# EAGLE design ISSI Driver OSRAM DEL (EAGLE 6.5.0)
Dev board for the ISSI driver with OSRAM LEDs

## Sheet 1 of 2: Drivers
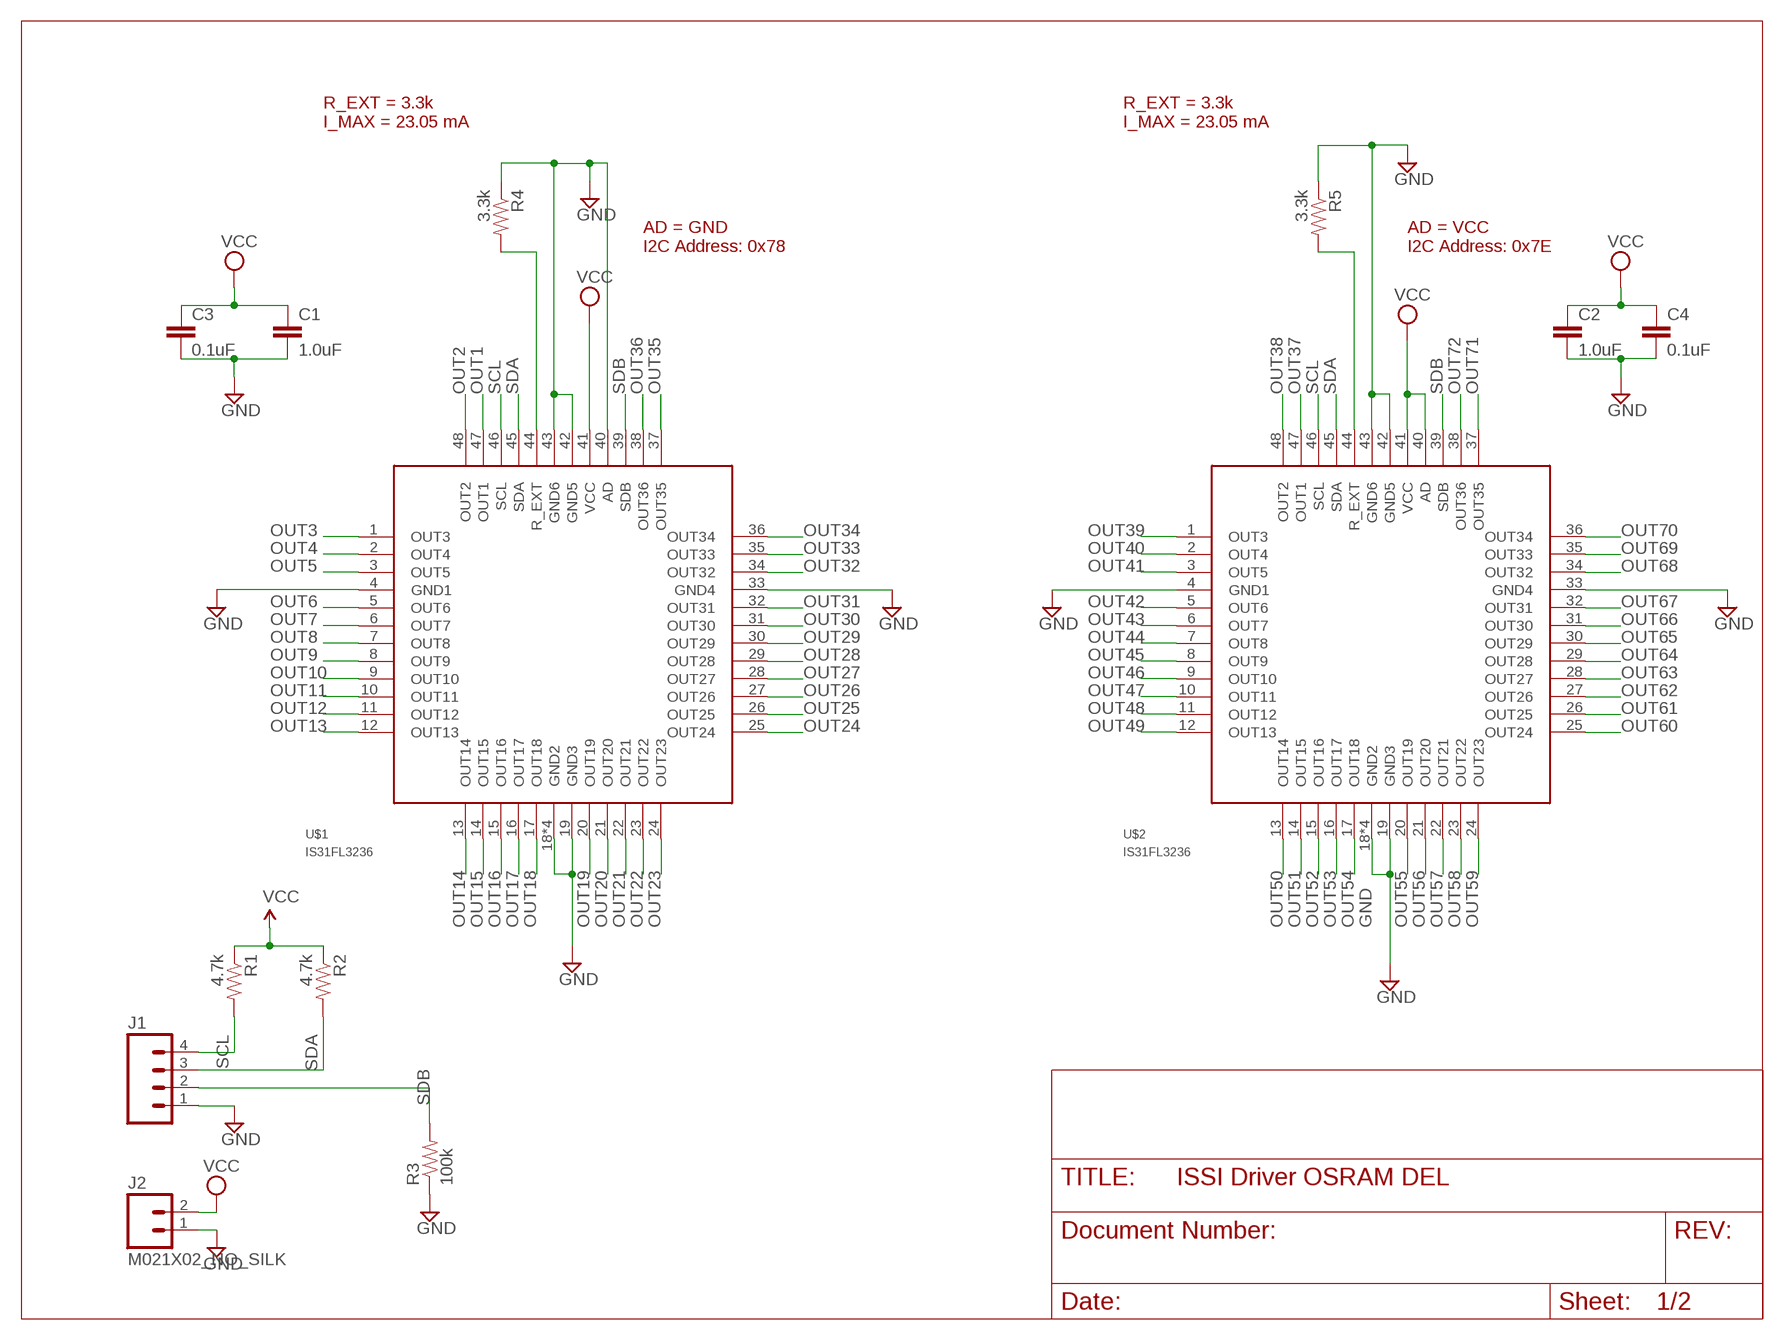
[diagram p0: schematic, sheet 1]

### Parts
C1  1.0uF  1.0UF-16V-10%(0603)  [0603-CAP]
C2  1.0uF  1.0UF-16V-10%(0603)  [0603-CAP]
C3  0.1uF  0.1UF-25V-5%(0603)  [0603-CAP]
C4  0.1uF  0.1UF-25V-5%(0603)  [0603-CAP]
J1  M041X04_NO_SILK  [1X04_NO_SILK]
J2  M021X02_NO_SILK  [1X02_NO_SILK]
R1  4.7k  4.7KOHM1/10W1%(0603)  [0603]
R2  4.7k  4.7KOHM1/10W1%(0603)  [0603]
R3  100k  100KOHM1/10W1%(0603)  [0603-RES]
R4  3.3k  8.2KOHM-1/10W-5%(0603)  [0603-RES]
R5  3.3k  8.2KOHM-1/10W-5%(0603)  [0603-RES]
U$1  IS31FL3236  [TQFP48]
U$2  IS31FL3236  [TQFP48]

### Nets
GND [GND]: C1.2 C2.2 C3.2 C4.2 J1.1 J2.1 R3.1 R4.1 R5.1 U$1.4(GND1) U$1.18(GND2) U$1.19(GND3) U$1.33(GND4) U$1.40(AD) U$1.42(GND5) U$1.43(GND6) U$1.THERMALPAD(GND2) U$1.THERMALVIA1(GND2) U$1.THERMALVIA2(GND2) U$2.4(GND1) U$2.18(GND2) U$2.19(GND3) U$2.33(GND4) U$2.42(GND5) U$2.43(GND6) U$2.THERMALPAD(GND2) U$2.THERMALVIA1(GND2) U$2.THERMALVIA2(GND2)
N$5: R4.2 U$1.44(R_EXT)
N$44: R5.2 U$2.44(R_EXT)
OUT1: U$1.47(OUT1) ; also sheet 2
OUT2: U$1.48(OUT2) ; also sheet 2
OUT3: U$1.1(OUT3) ; also sheet 2
OUT4: U$1.2(OUT4) ; also sheet 2
OUT5: U$1.3(OUT5) ; also sheet 2
OUT6: U$1.5(OUT6) ; also sheet 2
OUT7: U$1.6(OUT7) ; also sheet 2
OUT8: U$1.7(OUT8) ; also sheet 2
OUT9: U$1.8(OUT9) ; also sheet 2
OUT10: U$1.9(OUT10) ; also sheet 2
OUT11: U$1.10(OUT11) ; also sheet 2
OUT12: U$1.11(OUT12) ; also sheet 2
OUT13: U$1.12(OUT13) ; also sheet 2
OUT14: U$1.13(OUT14) ; also sheet 2
OUT15: U$1.14(OUT15) ; also sheet 2
OUT16: U$1.15(OUT16) ; also sheet 2
OUT17: U$1.16(OUT17) ; also sheet 2
OUT18: U$1.17(OUT18) ; also sheet 2
OUT19: U$1.20(OUT19) ; also sheet 2
OUT20: U$1.21(OUT20) ; also sheet 2
OUT21: U$1.22(OUT21) ; also sheet 2
OUT22: U$1.23(OUT22) ; also sheet 2
OUT23: U$1.24(OUT23) ; also sheet 2
OUT24: U$1.25(OUT24) ; also sheet 2
OUT25: U$1.26(OUT25) ; also sheet 2
OUT26: U$1.27(OUT26) ; also sheet 2
OUT27: U$1.28(OUT27) ; also sheet 2
OUT28: U$1.29(OUT28) ; also sheet 2
OUT29: U$1.30(OUT29) ; also sheet 2
OUT30: U$1.31(OUT30) ; also sheet 2
OUT31: U$1.32(OUT31) ; also sheet 2
OUT32: U$1.34(OUT32) ; also sheet 2
OUT33: U$1.35(OUT33) ; also sheet 2
OUT34: U$1.36(OUT34) ; also sheet 2
OUT35: U$1.37(OUT35) ; also sheet 2
OUT36: U$1.38(OUT36) ; also sheet 2
OUT37: U$2.47(OUT1) ; also sheet 2
OUT38: U$2.48(OUT2) ; also sheet 2
OUT39: U$2.1(OUT3) ; also sheet 2
OUT40: U$2.2(OUT4) ; also sheet 2
OUT41: U$2.3(OUT5) ; also sheet 2
OUT42: U$2.5(OUT6) ; also sheet 2
OUT43: U$2.6(OUT7) ; also sheet 2
OUT44: U$2.7(OUT8) ; also sheet 2
OUT45: U$2.8(OUT9) ; also sheet 2
OUT46: U$2.9(OUT10) ; also sheet 2
OUT47: U$2.10(OUT11) ; also sheet 2
OUT48: U$2.11(OUT12) ; also sheet 2
OUT49: U$2.12(OUT13) ; also sheet 2
OUT50: U$2.13(OUT14) ; also sheet 2
OUT51: U$2.14(OUT15) ; also sheet 2
OUT52: U$2.15(OUT16) ; also sheet 2
OUT53: U$2.16(OUT17) ; also sheet 2
OUT54: U$2.17(OUT18) ; also sheet 2
OUT55: U$2.20(OUT19) ; also sheet 2
OUT56: U$2.21(OUT20) ; also sheet 2
OUT57: U$2.22(OUT21) ; also sheet 2
OUT58: U$2.23(OUT22) ; also sheet 2
OUT59: U$2.24(OUT23) ; also sheet 2
OUT60: U$2.25(OUT24) ; also sheet 2
OUT61: U$2.26(OUT25) ; also sheet 2
OUT62: U$2.27(OUT26) ; also sheet 2
OUT63: U$2.28(OUT27) ; also sheet 2
OUT64: U$2.29(OUT28) ; also sheet 2
OUT65: U$2.30(OUT29) ; also sheet 2
OUT66: U$2.31(OUT30) ; also sheet 2
OUT67: U$2.32(OUT31) ; also sheet 2
OUT68: U$2.34(OUT32) ; also sheet 2
OUT69: U$2.35(OUT33) ; also sheet 2
OUT70: U$2.36(OUT34) ; also sheet 2
OUT71: U$2.37(OUT35) ; also sheet 2
OUT72: U$2.38(OUT36) ; also sheet 2
SCL: J1.4 R1.2 U$1.46(SCL) U$2.46(SCL)
SDA: J1.3 R2.2 U$1.45(SDA) U$2.45(SDA)
SDB: J1.2 R3.2 U$1.39(SDB) U$2.39(SDB)
VCC [VCC]: C1.1 C2.1 C3.1 C4.1 J2.2 R1.1 R2.1 U$1.41(VCC) U$2.40(AD) U$2.41(VCC) ; also sheet 2

### Notes on the sheet
- R_EXT = 3.3k
  I_MAX = 23.05 mA
- R_EXT = 3.3k
  I_MAX = 23.05 mA
- AD = GND
  I2C Address: 0x78
- AD = VCC
  I2C Address: 0x7E

## Sheet 2 of 2: LEDS
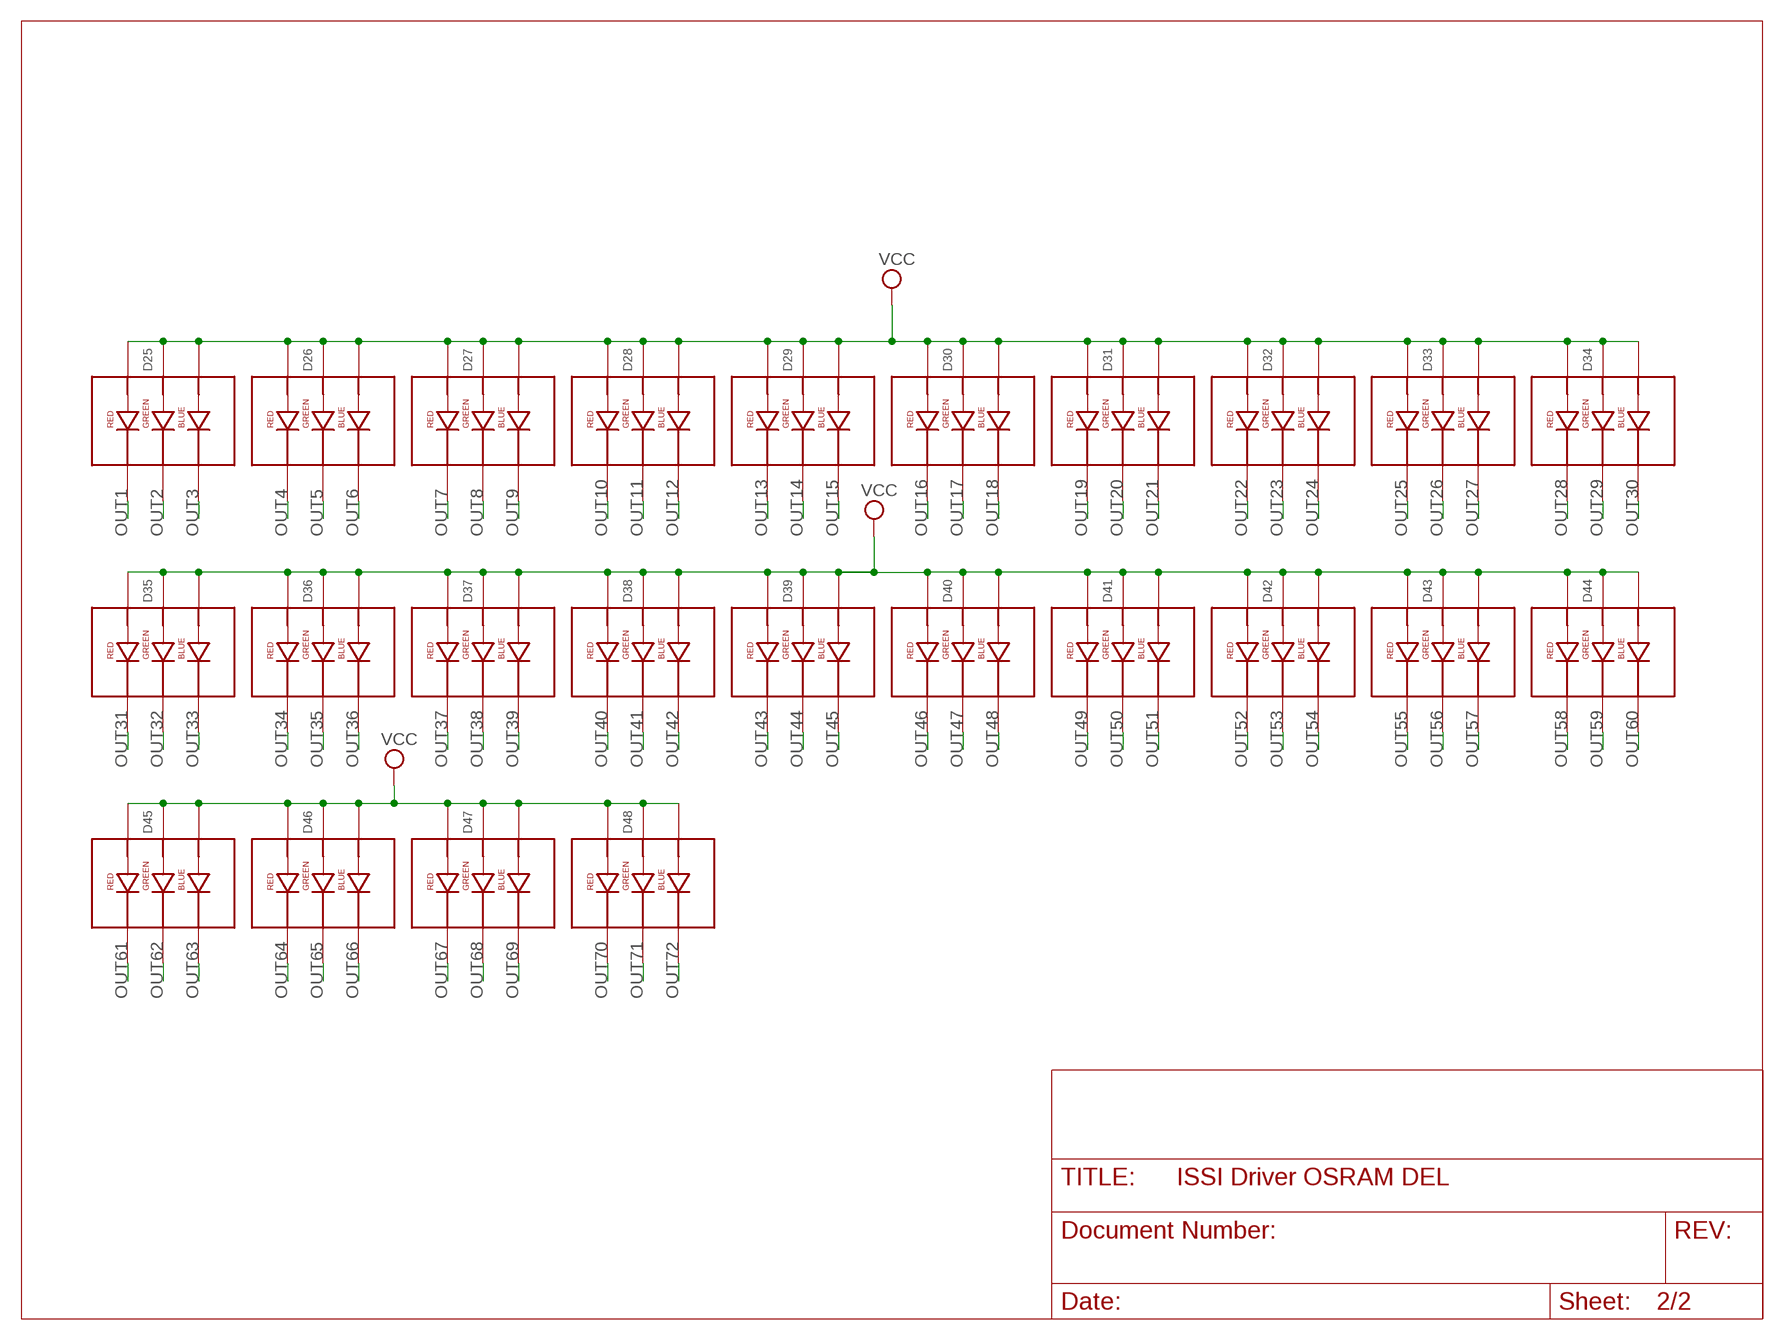
[diagram p1: schematic, sheet 2]

### Parts
D25  LRTB_GVTG-U5V5-1LPCC6SMALL  [LPCC6SMALL]
D26  LRTB_GVTG-U5V5-1LPCC6SMALL  [LPCC6SMALL]
D27  LRTB_GVTG-U5V5-1LPCC6SMALL  [LPCC6SMALL]
D28  LRTB_GVTG-U5V5-1LPCC6SMALL  [LPCC6SMALL]
D29  LRTB_GVTG-U5V5-1LPCC6SMALL  [LPCC6SMALL]
D30  LRTB_GVTG-U5V5-1LPCC6SMALL  [LPCC6SMALL]
D31  LRTB_GVTG-U5V5-1LPCC6SMALL  [LPCC6SMALL]
D32  LRTB_GVTG-U5V5-1LPCC6SMALL  [LPCC6SMALL]
D33  LRTB_GVTG-U5V5-1LPCC6SMALL  [LPCC6SMALL]
D34  LRTB_GVTG-U5V5-1LPCC6SMALL  [LPCC6SMALL]
D35  LRTB_GVTG-U5V5-1LPCC6SMALL  [LPCC6SMALL]
D36  LRTB_GVTG-U5V5-1LPCC6SMALL  [LPCC6SMALL]
D37  LRTB_GVTG-U5V5-1LPCC6SMALL  [LPCC6SMALL]
D38  LRTB_GVTG-U5V5-1LPCC6SMALL  [LPCC6SMALL]
D39  LRTB_GVTG-U5V5-1LPCC6SMALL  [LPCC6SMALL]
D40  LRTB_GVTG-U5V5-1LPCC6SMALL  [LPCC6SMALL]
D41  LRTB_GVTG-U5V5-1LPCC6SMALL  [LPCC6SMALL]
D42  LRTB_GVTG-U5V5-1LPCC6SMALL  [LPCC6SMALL]
D43  LRTB_GVTG-U5V5-1LPCC6SMALL  [LPCC6SMALL]
D44  LRTB_GVTG-U5V5-1LPCC6SMALL  [LPCC6SMALL]
D45  LRTB_GVTG-U5V5-1LPCC6SMALL  [LPCC6SMALL]
D46  LRTB_GVTG-U5V5-1LPCC6SMALL  [LPCC6SMALL]
D47  LRTB_GVTG-U5V5-1LPCC6SMALL  [LPCC6SMALL]
D48  LRTB_GVTG-U5V5-1LPCC6SMALL  [LPCC6SMALL]

### Nets
OUT1: D25.C3(RED_CATHODE) ; also sheet 1
OUT2: D25.C2(GREEN_CATHODE) ; also sheet 1
OUT3: D25.C1(BLUE_CATHODE) ; also sheet 1
OUT4: D26.C3(RED_CATHODE) ; also sheet 1
OUT5: D26.C2(GREEN_CATHODE) ; also sheet 1
OUT6: D26.C1(BLUE_CATHODE) ; also sheet 1
OUT7: D27.C3(RED_CATHODE) ; also sheet 1
OUT8: D27.C2(GREEN_CATHODE) ; also sheet 1
OUT9: D27.C1(BLUE_CATHODE) ; also sheet 1
OUT10: D28.C3(RED_CATHODE) ; also sheet 1
OUT11: D28.C2(GREEN_CATHODE) ; also sheet 1
OUT12: D28.C1(BLUE_CATHODE) ; also sheet 1
OUT13: D29.C3(RED_CATHODE) ; also sheet 1
OUT14: D29.C2(GREEN_CATHODE) ; also sheet 1
OUT15: D29.C1(BLUE_CATHODE) ; also sheet 1
OUT16: D30.C3(RED_CATHODE) ; also sheet 1
OUT17: D30.C2(GREEN_CATHODE) ; also sheet 1
OUT18: D30.C1(BLUE_CATHODE) ; also sheet 1
OUT19: D31.C3(RED_CATHODE) ; also sheet 1
OUT20: D31.C2(GREEN_CATHODE) ; also sheet 1
OUT21: D31.C1(BLUE_CATHODE) ; also sheet 1
OUT22: D32.C3(RED_CATHODE) ; also sheet 1
OUT23: D32.C2(GREEN_CATHODE) ; also sheet 1
OUT24: D32.C1(BLUE_CATHODE) ; also sheet 1
OUT25: D33.C3(RED_CATHODE) ; also sheet 1
OUT26: D33.C2(GREEN_CATHODE) ; also sheet 1
OUT27: D33.C1(BLUE_CATHODE) ; also sheet 1
OUT28: D34.C3(RED_CATHODE) ; also sheet 1
OUT29: D34.C2(GREEN_CATHODE) ; also sheet 1
OUT30: D34.C1(BLUE_CATHODE) ; also sheet 1
OUT31: D35.C3(RED_CATHODE) ; also sheet 1
OUT32: D35.C2(GREEN_CATHODE) ; also sheet 1
OUT33: D35.C1(BLUE_CATHODE) ; also sheet 1
OUT34: D36.C3(RED_CATHODE) ; also sheet 1
OUT35: D36.C2(GREEN_CATHODE) ; also sheet 1
OUT36: D36.C1(BLUE_CATHODE) ; also sheet 1
OUT37: D37.C3(RED_CATHODE) ; also sheet 1
OUT38: D37.C2(GREEN_CATHODE) ; also sheet 1
OUT39: D37.C1(BLUE_CATHODE) ; also sheet 1
OUT40: D38.C3(RED_CATHODE) ; also sheet 1
OUT41: D38.C2(GREEN_CATHODE) ; also sheet 1
OUT42: D38.C1(BLUE_CATHODE) ; also sheet 1
OUT43: D39.C3(RED_CATHODE) ; also sheet 1
OUT44: D39.C2(GREEN_CATHODE) ; also sheet 1
OUT45: D39.C1(BLUE_CATHODE) ; also sheet 1
OUT46: D40.C3(RED_CATHODE) ; also sheet 1
OUT47: D40.C2(GREEN_CATHODE) ; also sheet 1
OUT48: D40.C1(BLUE_CATHODE) ; also sheet 1
OUT49: D41.C3(RED_CATHODE) ; also sheet 1
OUT50: D41.C2(GREEN_CATHODE) ; also sheet 1
OUT51: D41.C1(BLUE_CATHODE) ; also sheet 1
OUT52: D42.C3(RED_CATHODE) ; also sheet 1
OUT53: D42.C2(GREEN_CATHODE) ; also sheet 1
OUT54: D42.C1(BLUE_CATHODE) ; also sheet 1
OUT55: D43.C3(RED_CATHODE) ; also sheet 1
OUT56: D43.C2(GREEN_CATHODE) ; also sheet 1
OUT57: D43.C1(BLUE_CATHODE) ; also sheet 1
OUT58: D44.C3(RED_CATHODE) ; also sheet 1
OUT59: D44.C2(GREEN_CATHODE) ; also sheet 1
OUT60: D44.C1(BLUE_CATHODE) ; also sheet 1
OUT61: D45.C3(RED_CATHODE) ; also sheet 1
OUT62: D45.C2(GREEN_CATHODE) ; also sheet 1
OUT63: D45.C1(BLUE_CATHODE) ; also sheet 1
OUT64: D46.C3(RED_CATHODE) ; also sheet 1
OUT65: D46.C2(GREEN_CATHODE) ; also sheet 1
OUT66: D46.C1(BLUE_CATHODE) ; also sheet 1
OUT67: D47.C3(RED_CATHODE) ; also sheet 1
OUT68: D47.C2(GREEN_CATHODE) ; also sheet 1
OUT69: D47.C1(BLUE_CATHODE) ; also sheet 1
OUT70: D48.C3(RED_CATHODE) ; also sheet 1
OUT71: D48.C2(GREEN_CATHODE) ; also sheet 1
OUT72: D48.C1(BLUE_CATHODE) ; also sheet 1
VCC [VCC]: D25.A1(BLUE_ANODE) D25.A2(GREEN_ANODE) D25.A3(RED_ANODE) D26.A1(BLUE_ANODE) D26.A2(GREEN_ANODE) D26.A3(RED_ANODE) D27.A1(BLUE_ANODE) D27.A2(GREEN_ANODE) D27.A3(RED_ANODE) D28.A1(BLUE_ANODE) D28.A2(GREEN_ANODE) D28.A3(RED_ANODE) D29.A1(BLUE_ANODE) D29.A2(GREEN_ANODE) D29.A3(RED_ANODE) D30.A1(BLUE_ANODE) D30.A2(GREEN_ANODE) D30.A3(RED_ANODE) D31.A1(BLUE_ANODE) D31.A2(GREEN_ANODE) D31.A3(RED_ANODE) D32.A1(BLUE_ANODE) D32.A2(GREEN_ANODE) D32.A3(RED_ANODE) D33.A1(BLUE_ANODE) D33.A2(GREEN_ANODE) D33.A3(RED_ANODE) D34.A1(BLUE_ANODE) D34.A2(GREEN_ANODE) D34.A3(RED_ANODE) D35.A1(BLUE_ANODE) D35.A2(GREEN_ANODE) D35.A3(RED_ANODE) D36.A1(BLUE_ANODE) D36.A2(GREEN_ANODE) D36.A3(RED_ANODE) D37.A1(BLUE_ANODE) D37.A2(GREEN_ANODE) D37.A3(RED_ANODE) D38.A1(BLUE_ANODE) D38.A2(GREEN_ANODE) D38.A3(RED_ANODE) D39.A1(BLUE_ANODE) D39.A2(GREEN_ANODE) D39.A3(RED_ANODE) D40.A1(BLUE_ANODE) D40.A2(GREEN_ANODE) D40.A3(RED_ANODE) D41.A1(BLUE_ANODE) D41.A2(GREEN_ANODE) D41.A3(RED_ANODE) D42.A1(BLUE_ANODE) D42.A2(GREEN_ANODE) D42.A3(RED_ANODE) D43.A1(BLUE_ANODE) D43.A2(GREEN_ANODE) D43.A3(RED_ANODE) D44.A1(BLUE_ANODE) D44.A2(GREEN_ANODE) D44.A3(RED_ANODE) D45.A1(BLUE_ANODE) D45.A2(GREEN_ANODE) D45.A3(RED_ANODE) D46.A1(BLUE_ANODE) D46.A2(GREEN_ANODE) D46.A3(RED_ANODE) D47.A1(BLUE_ANODE) D47.A2(GREEN_ANODE) D47.A3(RED_ANODE) D48.A1(BLUE_ANODE) D48.A2(GREEN_ANODE) D48.A3(RED_ANODE) ; also sheet 1

## Library data of the parts
C1 C2 = SparkFun-Capacitors:1.0UF-16V-10%(0603): CAP-00868; PROD_ID: CAP-00868
C3 C4 = SparkFun-Capacitors:0.1UF-25V-5%(0603): CAP-08604; PROD_ID: CAP-08604
D25-D48 = issi:LRTB_GVTG-U5V5-1: Osram LRTB GVTG RGB MULTILED Source: http://www.osram-os.com/Graphics/XPic9/00155765_0.pdf/LRTB%20GVTG%20-%20MULTILED.pdf
J1 = SparkFun-Connectors:M04: Header 4 Standard 4-pin 0.1" header. Use with straight break away headers (SKU : PRT-00116), right angle break away headers (PRT-00553), swiss pins (PRT-00743), machine pins (PRT-00117), and female headers (PRT-00115). Molex polarized connector foot print use with SKU : PRT-08231 with associated crimp pins and housings. 1MM SMD Version SKU: PRT-10208
J2 = SparkFun-Connectors:M02: Standard 2-pin 0.1" header. Use with - straight break away headers ( PRT-00116) - right angle break away headers (PRT-00553) - swiss pins (PRT-00743) - machine pins (PRT-00117) - female headers (PRT-00115) Molex polarized connector foot print use with: PRT-08233 with associated crimp pins and housings. 2.54_SCREWTERM for use with PRT-10571. 3.5mm Screw Terminal footprints for PRT-08084 5mm Screw Terminal footprints for use with PRT-08433
R1 R2 = SparkFun-Resistors:4.7KOHM1/10W1%(0603): RES-07857; PROD_ID: RES-07857
R3 = SparkFun-Resistors:100KOHM1/10W1%(0603): RES-07828; PROD_ID: RES-07828
R4 R5 = SparkFun-Resistors:8.2KOHM-1/10W-5%(0603): RES-10646; PROD_ID: RES-10646
U$1 U$2 = issi:IS31FL3236: 36 CHANNELS LED DRIVER 36 constant current led driver channels with independent PWM control. Source: http://www.issi.com/WW/pdf/31FL3236.pdf

## Net classes
0 default: width 0.203 mm, drill 0.33 mm, clearance 0.152 mm
1 VCC: width 0.305 mm, drill 0.381 mm, clearance 0.203 mm
2 GND: width 0.305 mm, drill 0.381 mm, clearance 0.203 mm

## Board
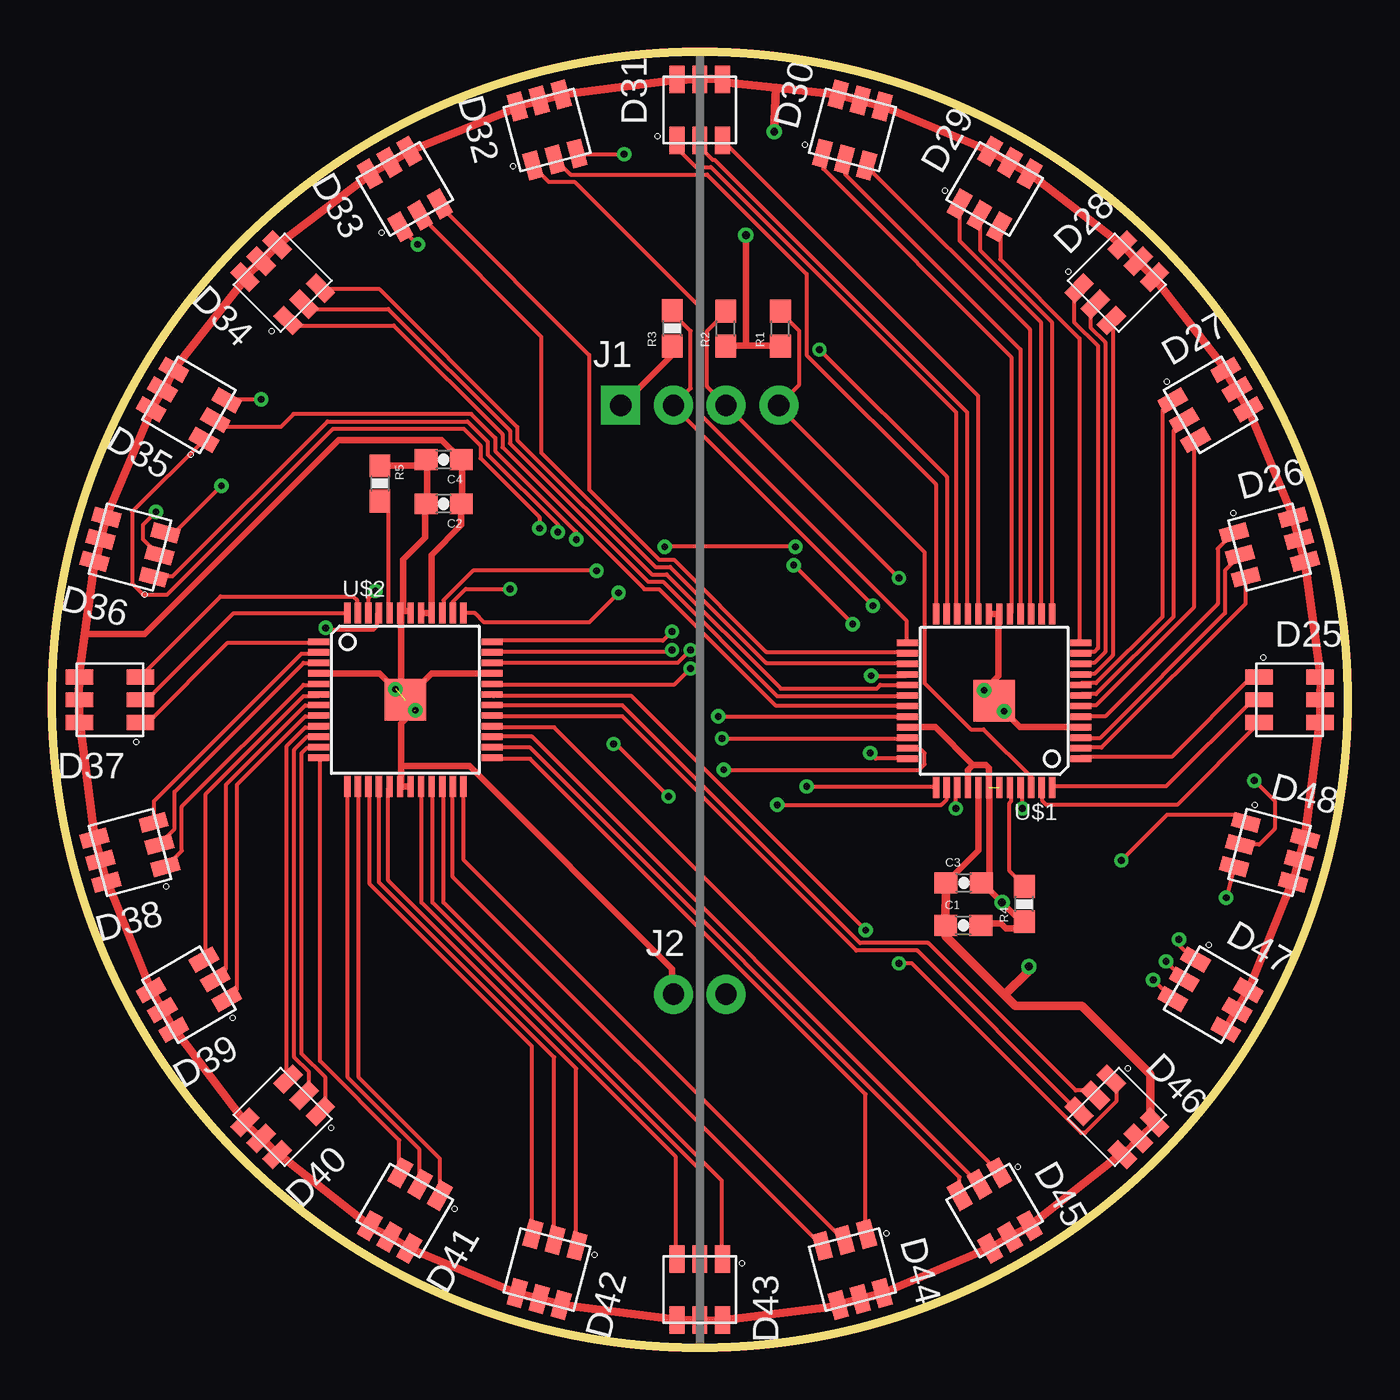
[diagram p2: board, top side]
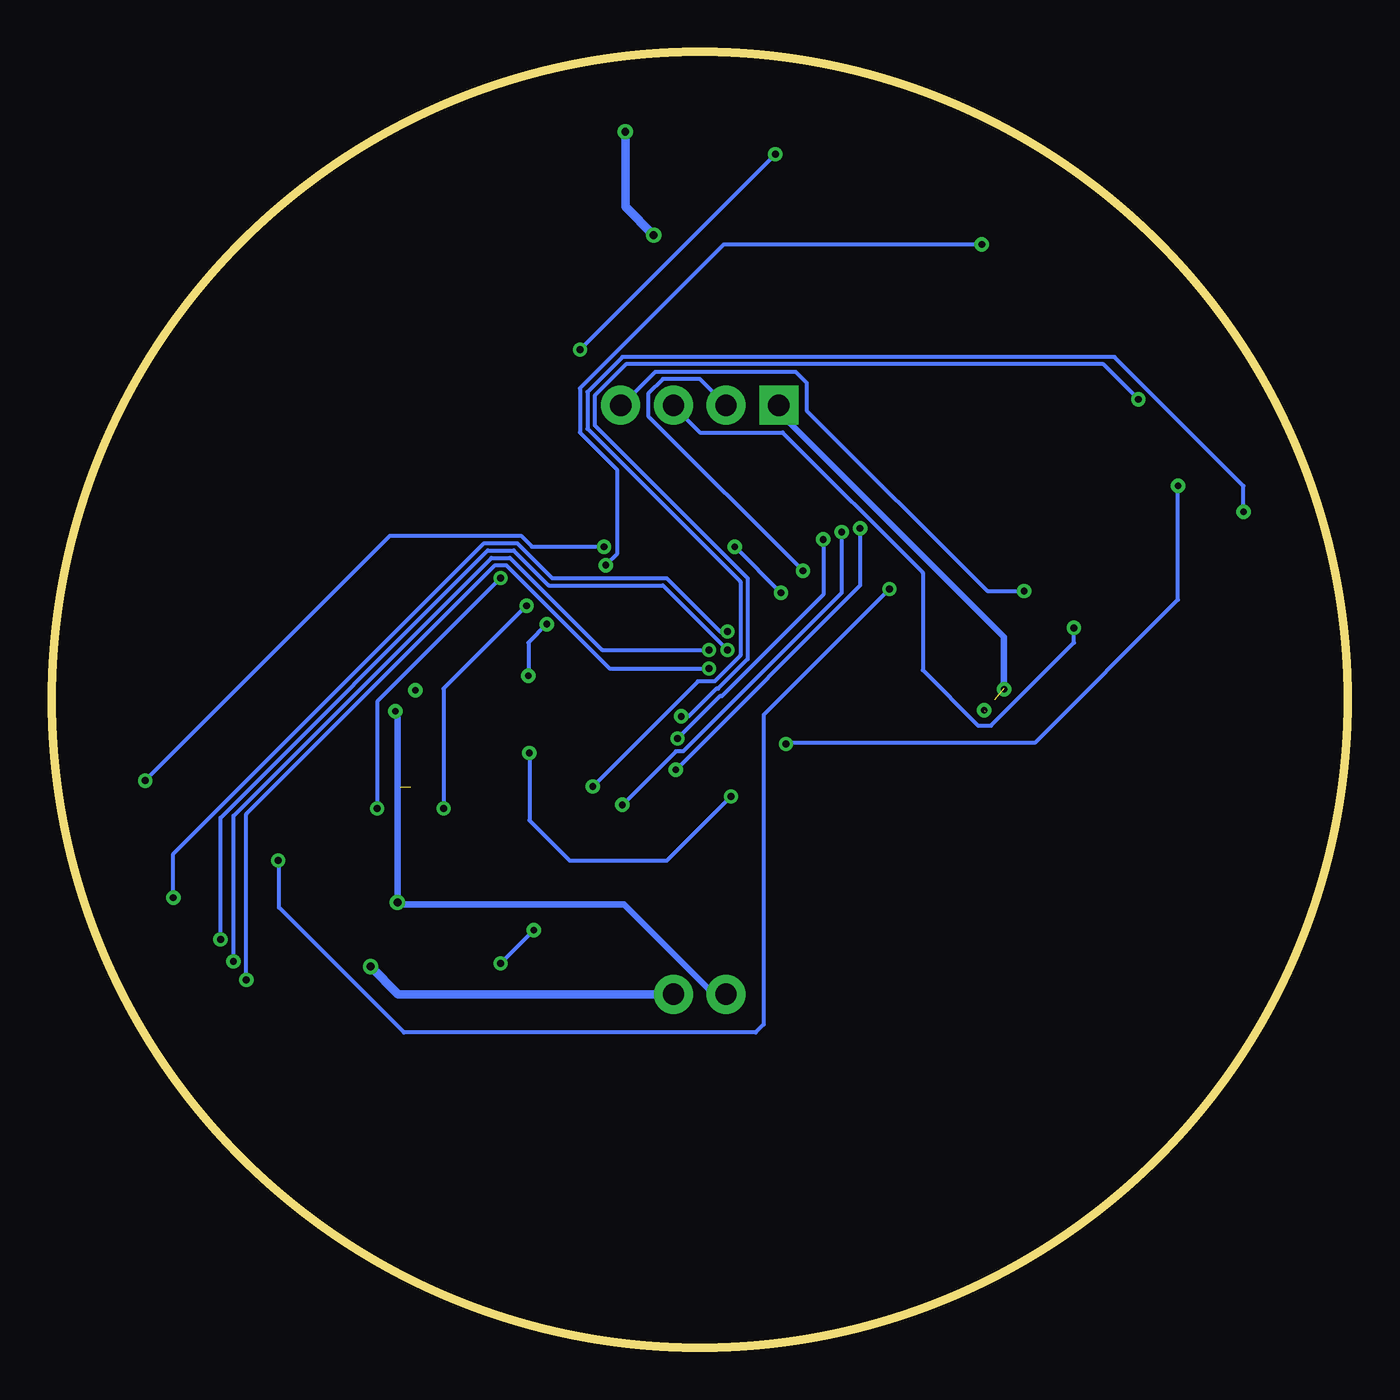
[diagram p3: board, bottom side, seen from below]

Size 62.5 x 62.5 mm. Coordinates in mm from the lower left corner, seen from the top.
Outline: circle at 31.25,31.25 radius 31.25
Copper layers (1*16): Top 0.0356mm / dielectric 1.5011mm / Bottom 0.0356mm
Design rules "LaenPCBOrder": minimum track width 6mil, minimum drill 13mil, track to track 6mil, track to pad 6mil, pad to pad 6mil, via to via 6mil, smd to smd 6mil, copper to edge 15mil, drill to drill 6mil, minimum pad ring 7mil, minimum via ring 7mil, stop-mask expansion 3mil, vias tented up to drill 0mil, thermal gap 10mil

### Footprints (pad centres in the part's own frame; a part is rotated, then mirrored left to right if it is on the bottom)
0603-CAP = smd 1.1 x 1: 1 -0.85,0; 2 0.85,0
LPCC6SMALL = smd 1.321 x 0.711: A1 -1.473,-1.1; A2 -1.473,0; A3 -1.473,1.1; C1 1.473,-1.1; C2 1.473,0; C3 1.473,1.1
1X04_NO_SILK = drill 1.016 pad 1.88 square: 1 0,0 | drill 1.016 pad 1.88: 2 2.54,0; 3 5.08,0; 4 7.62,0
1X02_NO_SILK = drill 1.016 pad 1.88: 1 0,0; 2 2.54,0
0603 = smd 1.1 x 1: 1 -0.85,0; 2 0.85,0
0603-RES = smd 1.1 x 1: 1 -0.85,0; 2 0.85,0
TQFP48 = smd 1.016 x 0.305: 1 -4.191,2.794; 2 -4.191,2.286; 3 -4.191,1.778; 4 -4.191,1.27; 5 -4.191,0.762; 6 -4.191,0.254; 7 -4.191,-0.254; 8 -4.191,-0.762; 9 -4.191,-1.27; 10 -4.191,-1.778; 11 -4.191,-2.286; 12 -4.191,-2.794; 25 4.191,-2.794; 26 4.191,-2.286; 27 4.191,-1.778; 28 4.191,-1.27; 29 4.191,-0.762; 30 4.191,-0.254; 31 4.191,0.254; 32 4.191,0.762; 33 4.191,1.27; 34 4.191,1.778; 35 4.191,2.286; 36 4.191,2.794 | smd 0.305 x 1.016: 13 -2.794,-4.191; 14 -2.286,-4.191; 15 -1.778,-4.191; 16 -1.27,-4.191; 17 -0.762,-4.191; 18 -0.254,-4.191; 19 0.254,-4.191; 20 0.762,-4.191; 21 1.27,-4.191; 22 1.778,-4.191; 23 2.286,-4.191; 24 2.794,-4.191; 37 2.794,4.191; 38 2.286,4.191; 39 1.778,4.191; 40 1.27,4.191; 41 0.762,4.191; 42 0.254,4.191; 43 -0.254,4.191; 44 -0.762,4.191; 45 -1.27,4.191; 46 -1.778,4.191; 47 -2.286,4.191; 48 -2.794,4.191 | smd 2 x 2: THERMALPAD 0,0 | drill 0.33 pad 0.61: THERMALVIA1 0.483,-0.508; THERMALVIA2 -0.483,0.508

### Placement (x,y rotation side)
C1  43.96,20.37 0 top
C2  18.9,40.7 180 top
C3  43.98,22.42 0 top
C4  18.9,42.83 180 top
D25  59.7,31.25 180 top
D26  58.73,38.61 195 top
D27  55.89,45.48 210 top
D28  51.37,51.37 225 top
D29  45.48,55.89 240 top
D30  38.61,58.73 255 top
D31  31.25,59.7 270 top
D32  23.89,58.73 285 top
D33  17.02,55.89 300 top
D34  11.13,51.37 315 top
D35  6.61,45.48 330 top
D36  3.77,38.61 345 top
D37  2.8,31.25 0 top
D38  3.77,23.89 15 top
D39  6.61,17.02 30 top
D40  11.13,11.13 45 top
D41  17.02,6.61 60 top
D42  23.89,3.77 75 top
D43  31.25,2.8 90 top
D44  38.61,3.77 105 top
D45  45.48,6.61 120 top
D46  51.37,11.13 135 top
D47  55.89,17.02 150 top
D48  58.73,23.89 165 top
J1  27.44,45.45 0 top
J2  29.98,17.05 0 top
R1  35.14,49.15 90 top
R2  32.5,49.15 90 top
R3  29.93,49.16 90 top
R4  46.91,21.4 90 top
R5  15.82,41.68 270 top
U$1  45.45,31.2 180 top
U$2  17.05,31.25 0 top

### Tracks (layer width: path | path; a pad name or v marks a point on that pad's centre or on a via)
GND  (via drill 0.38)  (3 unrouted)
  Top 0.305: R3.1 29.92,48.23 29.92,47.87 27.52,45.47 J1.1 | R5.1 15.87,42.54 18,42.54 C4.2 18.09,42.81 18.09,40.76 C2.2 18,40.59 18,39.07 16.94,38.01 16.94,35.52 | 16.85,28.05 16.85,30.09 17.47,30.72 | 16.85,28.05 16.85,27.07 | 16.85,27.07 U$2.18 | U$2.THERMALVIA1 17.56,30.8 U$2.THERMALPAD 18.32,32.52 U$2.33 | 16.94,35.52 U$2.43 16.85,35.43 16.85,32.05 16.58,31.78 U$2.THERMALVIA2 15.8,32.52 U$2.4 | 45.03,31.78 45.65,32.41 45.65,35.34 U$1.18 U$1.19 | 45.03,31.78 U$1.THERMALVIA1 | 45.03,31.78 U$1.THERMALPAD 45.56,31.16 46.01,30.72 U$1.THERMALVIA2 46.7,29.93 U$1.4 | 16.85,28.05 20.14,28.05 29.92,18.27 29.92,17.12 J2.1 | 16.94,35.52 17.23,35.52 U$2.42 | 16.85,27.07 17.29,27.07 U$2.19 | U$1.40 44.18,27.86 44.43,28.11 | 44.43,28.11 45.04,28.11 45.2,27.95 U$1.42 45.21,27 45.21,22.8 C3.2 44.88,22.42 v45.83,21.47 46.72,20.58 46.9,20.58 R4.1 46.58,20.22 46.01,20.22 45.78,20.45 44.81,20.45 C1.2 | U$1.33 42.61,29.93 44.43,28.11
  Bottom 0.305: J1.1 27.43,45.38 27.43,45.12 16.58,34.27 16.58,31.78 U$2.THERMALVIA2 | U$1.THERMALVIA2 45.92,30.63 45.83,30.54 v45.83,21.47 45.74,21.38 34.9,21.38 30.63,17.12 30,17.12 J2.1
N$1
  Top 0.305: 12.87,32.52 12.88,32.51
N$5
  Top 0.203: U$1.44 46.27,26.98 46.27,26.36 46.19,26.27 46.19,22.98 46.9,22.27 R4.2
N$44
  Top 0.203: U$2.44 16.23,35.52 16.23,40.41 15.87,40.76 R5.2
OUT1
  Top 0.203: U$1.47 47.78,26.98 47.78,26.36 47.96,26.18 54.27,26.18 58.19,30.09 D25.C3
OUT2
  Top 0.203: D25.C2 57.92,31.25 53.74,27.07 48.32,27.07 U$1.48
OUT3
  Top 0.203: U$1.1 49.65,28.49 54.01,28.49 57.83,32.32 58.19,32.32 D25.C1
OUT4
  Top 0.203: U$1.2 49.65,28.94 50.63,28.94 57.56,35.87 57.56,37.12 D26.C3
OUT5
  Top 0.203: U$1.3 49.65,29.38 50.54,29.38 56.59,35.43 56.59,37.47 57.3,38.18 D26.C2
OUT6
  Top 0.203: U$1.5 49.65,30.45 50.81,30.45 56.23,35.87 56.23,38.54 56.94,39.25 D26.C1
OUT7
  Top 0.203: U$1.6 49.65,30.98 50.36,30.98 55.08,35.7 55.08,43.78 D27.C3
OUT8
  Top 0.203: U$1.7 49.65,31.52 50.36,31.52 54.1,35.25 54.1,44.23 54.54,44.67 D27.C2
OUT9
  Top 0.203: U$1.8 49.65,32.05 50.36,32.05 53.56,35.25 53.56,45.21 54.01,45.65 D27.C1
OUT10
  Top 0.203: U$1.9 49.65,32.49 50.27,32.49 51.16,33.38 51.16,49.47 D28.C3
OUT11
  Top 0.203: D28.C2 50.1,50.1 50.1,49.21 50.81,48.5 50.81,33.56 50.27,33.03 49.65,33.03 U$1.10
OUT12
  Top 0.203: U$1.11 49.65,33.56 50.27,33.56 50.45,33.74 50.45,48.32 49.3,49.47 49.3,50.9 49.47,51.08 D28.C1
OUT13
  Top 0.203: U$1.12 49.56,34.01 49.56,48.67 45.74,52.5 45.74,54.01 D29.C3
OUT14
  Top 0.203: U$1.13 48.23,35.43 48.23,49.47 44.76,52.94 44.76,54.54 D29.C2
OUT15
  Top 0.203: U$1.14 47.7,35.43 47.7,49.47 43.78,53.39 43.78,55.08 D29.C1
OUT16
  Top 0.203: U$1.15 47.16,35.43 47.16,49.12 39.34,56.94 D30.C3
OUT17
  Top 0.203: U$1.16 46.72,35.43 46.72,48.14 38.27,56.59 38.27,57.3 D30.C2
OUT18
  Top 0.203: U$1.17 46.27,35.43 46.27,47.78 37.21,56.85 37.21,57.56 D30.C1
OUT19
  Top 0.203: U$1.20 44.67,35.43 44.67,45.92 32.41,58.19 D31.C3
OUT20
  Top 0.203: D31.C2 31.25,57.92 31.87,57.3 31.96,57.3 44.14,45.12 44.14,35.43 U$1.21
OUT21
  Top 0.203: U$1.22 43.61,35.43 43.61,45.12 31.78,56.94 31.07,56.94 30.18,57.83 30.18,58.19 D31.C1
OUT22  (via drill 0.33)
  Top 0.203: v37.03,48.14 43.16,42.01 43.16,35.43 U$1.23 | v27.61,57.56 25.38,57.56 D32.C3
  Bottom 0.203: v27.61,57.56 v37.03,48.14
OUT23
  Top 0.203: U$1.24 42.63,35.43 42.63,41.65 36.41,47.87 36.41,51.79 31.61,56.59 25.03,56.59 24.32,57.3 D32.C2
OUT24
  Top 0.203: U$1.25 41.21,34.01 41.21,35.07 31.25,45.03 31.25,50.19 25.2,56.23 23.96,56.23 23.25,56.94 D32.C1
OUT25
  Top 0.203: U$1.26 41.21,33.56 34.45,33.56 30,38.01 29.29,38.01 25.92,41.38 25.92,47.87 18.71,55.08 D33.C3
OUT26
  Top 0.203: U$1.27 41.21,33.03 34.45,33.03 29.83,37.65 29.12,37.65 23.61,43.16 23.61,48.76 17.83,54.54 D33.C2
OUT27  (via drill 0.33)
  Top 0.203: v39.52,32.41 41.21,32.41 U$1.28 | v35.78,37.74 v38.63,34.9 | v17.65,53.21 16.85,54.01 D33.C1
  Bottom 0.203: v39.52,32.41 39.52,34.01 v38.63,34.9 | v35.78,37.74 35.25,38.27 35.25,42.36 37.03,44.14 37.03,46.27 30.09,53.21 v17.65,53.21
OUT28
  Top 0.203: U$1.29 41.21,31.96 39.96,31.96 39.78,31.78 35.16,31.78 29.65,37.3 28.94,37.3 22.45,43.78 22.45,44.41 15.78,51.08 13.03,51.08 D34.C3
OUT29
  Top 0.203: D34.C2 12.4,50.1 16.23,50.1 22.09,44.23 22.09,43.61 28.76,36.94 29.47,36.94 34.98,31.43 41.21,31.43 U$1.30
OUT30
  Top 0.203: U$1.31 41.21,30.98 34.9,30.98 29.29,36.58 28.58,36.58 21.74,43.43 21.74,44.05 16.49,49.3 11.6,49.3 11.43,49.47 D34.C1
OUT31  (via drill 0.33)
  Top 0.203: v32.14,30.45 41.21,30.45 U$1.32 | v10.09,45.74 8.49,45.74 D35.C3
  Bottom 0.203: v32.14,30.45 31.78,30.45 30.45,31.78 30.36,31.78 28.94,33.21 28.94,37.12 36.32,44.5 36.32,45.92 34.81,47.43 11.78,47.43 v10.09,45.74
OUT32  (via drill 0.33)
  Top 0.203: v32.32,29.38 41.21,29.38 U$1.34 | v25.29,38.98 25.29,39.34 21.38,43.25 21.38,43.87 20.23,45.03 11.66,45.03 11.05,44.42 8.21,44.42 D35.C2 7.96,44.76
  Bottom 0.203: v32.32,29.38 30.27,31.43 30.18,31.43 25.29,36.32 v25.29,38.98
OUT33  (via drill 0.33)
  Top 0.203: v32.41,27.87 41.83,27.87 42.1,28.14 42.1,28.67 41.92,28.85 41.3,28.85 U$1.35 | v23.52,39.52 23.52,40.05 20.67,42.9 20.67,43.52 19.87,44.32 13.56,44.32 5.56,36.32 4.4,36.32 3.87,36.85 3.87,40.32 D35.C1
  Bottom 0.203: v32.41,27.87 23.52,36.76 v23.52,39.52
OUT34  (via drill 0.33 pad 0.69)
  Top 0.203: U$1.36 39.74,28.41 v39.47,28.68 | v29.74,26.59 27.21,29.12 v27.09,29.12 | v8.18,41.57 5.9,39.29 D36.C3
  Bottom 0.203: v39.47,28.68 39.47,25.44 37.52,23.49 32.84,23.49 v29.74,26.59 | v27.09,29.12 27.01,29.2 15.06,29.2 8.18,36.08 v8.18,41.57
OUT35  (via drill 0.33)
  Top 0.203: v36.41,27.07 42.63,27.07 U$1.37 | v5.02,40.32 4.4,39.7 4.4,38.98 5.11,38.27 D36.C2
  Bottom 0.203: v36.41,27.07 31.34,32.14 30.54,32.14 29.29,33.38 29.29,36.94 36.67,44.32 36.67,46.1 34.98,47.78 11.25,47.78 5.02,41.56 v5.02,40.32
OUT36  (via drill 0.33)
  Top 0.203: v34.98,26.18 42.9,26.18 43.16,26.45 43.16,26.98 U$1.38 | v24.41,39.34 24.41,39.7 21.03,43.07 21.03,43.7 20.05,44.67 13.29,44.67 5.82,37.21 4.94,37.21 D36.C1
  Bottom 0.203: v34.98,26.18 32.41,28.76 32.05,28.76 24.41,36.41 v24.41,39.34
OUT37
  Top 0.203: U$2.47 14.71,35.52 14.71,36.05 14.54,36.23 8.14,36.23 4.31,32.41 D37.C3
OUT38
  Top 0.203: D37.C2 4.58,31.25 8.76,35.43 14.18,35.43 U$2.48
OUT39
  Top 0.203: U$2.1 12.85,34.01 8.49,34.01 4.67,30.18 4.31,30.18 D37.C1
OUT40
  Top 0.203: U$2.2 12.85,33.47 12.05,33.47 4.94,26.36 4.94,25.38 D38.C3
OUT41
  Top 0.203: U$2.3 12.14,33.03 5.91,26.8 5.91,25.03 5.2,24.32 D38.C2
OUT42
  Top 0.203: U$2.5 12.85,31.96 12.14,31.96 6.27,26.09 6.27,23.96 5.56,23.25 D38.C1
OUT43
  Top 0.203: U$2.6 12.85,31.43 12.14,31.43 7.43,26.72 7.43,18.71 D39.C3
OUT44
  Top 0.203: U$2.7 12.85,30.98 12.23,30.98 8.4,27.16 8.4,18.27 7.96,17.83 D39.C2
OUT45
  Top 0.203: U$2.8 12.85,30.45 12.23,30.45 8.94,27.16 8.94,17.29 8.49,16.85 D39.C1
OUT46
  Top 0.203: U$2.9 12.85,29.92 12.23,29.92 11.34,29.03 11.34,13.03 D40.C3
OUT47
  Top 0.203: U$2.10 12.31,29.47 11.69,28.85 11.69,14 12.4,13.29 12.4,12.4 D40.C2
OUT48
  Top 0.203: U$2.11 12.85,28.94 12.31,28.94 12.05,28.67 12.05,14.18 13.2,13.03 13.2,11.6 13.03,11.43 D40.C1
OUT49
  Top 0.203: U$2.12 12.94,28.41 12.94,13.83 16.76,10 16.76,8.49 D41.C3
OUT50
  Top 0.203: U$2.13 14.27,26.98 14.27,13.03 17.74,9.56 17.74,7.96 D41.C2
OUT51
  Top 0.203: U$2.14 14.8,26.98 14.8,13.03 18.71,9.11 18.71,7.43 D41.C1
OUT52
  Top 0.203: U$2.15 15.34,26.98 15.34,22.36 23.16,14.54 23.16,5.56 D42.C3
OUT53
  Top 0.203: U$2.16 15.78,26.98 15.78,22.45 24.23,14 24.23,5.2 D42.C2
OUT54
  Top 0.203: U$2.17 16.23,26.98 16.23,22.54 25.29,13.47 25.29,4.94 D42.C1
OUT55
  Top 0.203: U$2.20 17.83,26.98 17.83,21.47 30.09,9.2 30.09,4.31 D43.C3
OUT56
  Top 0.203: D43.C2 31.25,8.58 18.36,21.47 18.36,26.98 U$2.21
OUT57
  Top 0.203: U$2.22 18.89,26.98 18.89,21.47 32.32,8.05 32.32,4.31 D43.C1
OUT58
  Top 0.203: U$2.23 19.34,26.98 19.34,22.72 37.12,4.94 D44.C3
OUT59
  Top 0.203: U$2.24 19.87,26.98 19.87,23.52 38.18,5.2 D44.C2
OUT60
  Top 0.203: U$2.25 21.29,28.41 23.07,28.41 39.25,12.23 39.25,5.56 D44.C1
OUT61
  Top 0.203: U$2.26 21.29,28.94 23.07,28.94 43.78,8.23 43.78,7.43 D45.C3
OUT62
  Top 0.203: U$2.27 23.16,29.47 44.67,7.96 D45.C2
OUT63
  Top 0.203: U$2.28 21.29,29.92 24.23,29.92 45.65,8.49 D45.C1
OUT64
  Top 0.203: U$2.29 21.29,30.45 27.52,30.45 38.81,19.16 41.74,19.16 49.47,11.43 D46.C3
OUT65
  Top 0.203: D46.C2 50.1,12.4 49.39,12.4 42.27,19.52 38.98,19.52 27.52,30.98 21.29,30.98 U$2.30
OUT66  (via drill 0.33)
  Top 0.203: v39.25,20.14 27.96,31.43 21.29,31.43 U$2.31 | v40.85,18.54 41.47,18.54 49.65,10.36 49.83,10.36 51.34,11.87 51.34,12.76 51.16,12.94 D46.C1
  Bottom 0.203: v40.85,18.54 v39.25,20.14
OUT67  (via drill 0.33)
  Top 0.203: v30.8,32.76 30,31.96 21.29,31.96 U$2.32 | v53.12,17.74 54.01,16.85 D47.C3
  Bottom 0.203: v30.8,32.76 35.61,32.76 40.59,37.74 41.12,37.74 53.12,25.74 v53.12,17.74
OUT68  (via drill 0.33)
  Top 0.203: U$2.34 30.18,33.03 v30.8,33.65 | v53.74,18.63 54.54,17.83 D47.C2
  Bottom 0.203: v30.8,33.65 35.96,33.65 40.41,38.09 41.3,38.09 53.74,25.65 v53.74,18.63
OUT69  (via drill 0.33)
  Top 0.203: v29.92,33.65 29.83,33.56 21.29,33.56 U$2.35 | v54.36,19.69 54.36,19.43 55.08,18.71 D47.C1
  Bottom 0.203: v29.92,33.65 33.03,36.76 38.54,36.76 40.23,38.45 41.47,38.45 54.36,25.56 v54.36,19.69
OUT70  (via drill 0.33, 0.33 pad 0.69)
  Top 0.203: v29.92,34.54 29.47,34.09 21.29,34.09 U$2.36 | D48.C3 v56.64,21.7
  Bottom 0.203: v29.92,34.54 30.27,34.54 32.85,37.12 38.36,37.12 40.05,38.81 41.65,38.81 56.64,23.82 v56.64,21.7
OUT71  (via drill 0.33, 0.33 pad 0.69)
  Top 0.203: v27.34,36.41 25.92,34.98 20.85,34.98 20.4,35.43 19.87,35.43 U$2.37 | v35.87,38.63 v29.56,38.63 | 57.48,24.41 57.39,24.32 D48.C2 58.23,24.27 58.98,25.02 58.98,26.37 v58,27.35
  Bottom 0.203: v29.56,38.63 v27.34,36.41 | v35.87,38.63 39.34,38.63 39.87,39.16 46.19,39.16 v58,27.35
OUT72  (via drill 0.33, 0.33 pad 0.69)
  Top 0.203: U$2.38 19.34,35.52 19.34,35.96 19.97,36.59 v22.1,36.59 | v51.59,23.5 53.8,25.71 57.21,25.71 D48.C1
  Bottom 0.203: v22.1,36.59 28.17,30.52 28.17,15.59 28.56,15.2 45.51,15.2 51.54,21.23 51.54,23.45 v51.59,23.5
SCL  (via drill 0.33)
  Top 0.203: v15.6,36.49 15.25,36.14 15.25,35.52 U$2.46 | U$1.46 47.25,27.07 47.25,27.52 44.94,29.83 44.32,29.83 42.1,32.05 42.1,38.36 35.07,45.38 J1.4 35.07,45.47 36.05,46.45 36.05,49.03 35.16,49.92 R1.2
  Bottom 0.203: v15.6,36.49 17.38,36.49 26.09,45.21 26.09,46.54 26.63,47.07 33.38,47.07 34.98,45.47 J1.4
SDA  (via drill 0.33)
  Top 0.203: v13.2,34.72 13.29,34.63 15.52,34.63 15.69,34.81 15.69,35.43 U$2.45 | v46.81,26 46.81,26.98 U$1.45 | v40.85,37.12 32.58,45.38 J1.3 32.49,45.47 31.61,46.36 31.61,49.03 32.49,49.92 R2.2
  Bottom 0.203: v13.2,34.72 13.2,34.01 17.2,30 17.83,30 20.49,32.67 20.49,37.38 27.25,44.14 31.25,44.14 32.49,45.38 J1.3 | v46.81,26 46.81,31.16 v40.85,37.12
SDB  (via drill 0.33)
  Top 0.203: v43.61,26 43.61,26.98 U$1.39 | v39.61,35.78 30,45.38 J1.2 30,45.47 30.8,46.27 30.8,49.03 30,49.83 30,50.01 R3.2 | v26.27,37.47 20.31,37.47 18.89,36.05 18.89,35.52 U$2.39
  Bottom 0.203: v43.61,26 43.61,31.78 v39.61,35.78 | v26.27,37.47 33.74,44.94 33.74,46.01 33.03,46.72 31.25,46.72 30,45.47 J1.2
VCC  (via drill 0.38, 0.38 pad 0.69)
  Top 0.305: D44.A1 40.14,2.71 | 30.18,1.29 D43.A3 30,1.38 | 31.25,1.29 D43.A2 31.34,1.29 | 32.32,1.29 D43.A1 32.49,1.38 | 24.67,2 D42.A1 | 37.83,2 D44.A3 | 47.16,5.82 D45.A1 47.25,6 | 46.27,5.47 D45.A2 | D46.A1 53.12,10.8 52.5,10.18 D46.A2 51.7,9.38 D46.A3 51.52,9.29 | 45.12,4.76 D45.A3 | 61.21,30.18 D25.A3 61.12,30 | 61.21,31.25 D25.A2 61.21,31.34 | 61.21,32.32 D25.A1 61.12,32.49 | 60.5,24.67 D48.A1 | 60.5,37.83 D26.A3 | 53.12,51.7 D28.A3 53.21,51.52 | D28.A2 52.32,52.5 | 51.7,53.12 D28.A1 51.52,53.21 | 47.25,56.5 D29.A3 | 56.5,47.25 D27.A1 | 59.79,40.14 D26.A1 | 57.74,45.12 D27.A3 | 5.82,47.16 D35.A3 6,47.25 | 5.47,46.27 D35.A2 | 9.38,51.7 D34.A1 9.29,51.52 | D34.A2 | 15.25,56.5 D33.A1 | 10.98,53.21 D34.A3 | 33.47,48.32 35.07,48.32 R1.1 | 33.47,48.32 32.58,48.32 R2.1 | 30.18,61.21 D31.A1 30,61.12 | 31.25,61.21 D31.A2 31.34,61.21 | 32.32,61.21 D31.A3 32.41,61.03 | v33.47,53.65 33.47,48.32 | 24.67,60.5 D32.A3 | 37.83,60.32 D30.A1 | 17.38,57.74 D33.A3 | 22.36,59.79 D32.A1 | 16.23,5.38 D41.A2 | 15.34,5.82 D41.A3 15.25,6 | 10,10.09 D40.A2 10.18,10 | 9.29,10.8 D40.A3 9.29,10.98 | 10.8,9.38 D40.A1 10.98,9.29 | 6,15.25 D39.A1 | 1.29,30.18 D37.A1 1.38,30 | 1.29,31.25 D37.A2 1.29,31.34 | 1.29,32.32 D37.A3 1.38,32.49 | 2.09,37.83 D36.A1 | 2,24.67 D38.A3 | 4.76,17.38 D39.A3 | 2.71,22.36 D38.A1 | 4.76,45.12 D35.A1 | 2.71,40.14 D36.A3 | 45.12,57.74 D29.A1 | 57.74,17.38 D47.A1 | 59.79,22.36 D48.A3 | U$2.41 U$2.40 18.32,38.24 19.75,39.67 C2.1 19.78,40.76 19.78,42.81 C4.1 19.69,42.9 18.8,43.78 13.83,43.78 4.47,34.43 1.58,34.43 | U$1.41 44.69,23.98 C3.1
  Top 0.406: 53.21,51.52 53.2,51.55 D27.A1 | 61.12,30 D48.A1 D48.A2 D48.A3 | 59.79,22.36 D47.A1 D47.A2 D47.A3 | C3.1 C1.1 43.11,19.85 45.95,17.01 | 45.95,17.01 46.48,16.48 49.68,16.48 52.99,13.17 52.99,11.07 D46.A1 | v47.12,18.38 47.12,18.17 45.95,17.01 | 34.92,60.76 D30.A1 D30.A2 D30.A3 D29.A1 D29.A2 D29.A3 D28.A1 | v34.84,58.65 34.92,60.76 | 22.36,59.79 D33.A3 D33.A2 D33.A1 | 15.25,56.5 D34.A3 D34.A2 9.38,51.7 | 9.29,51.52 D35.A3 5.47,46.27 | 4.76,45.12 D36.A3 D36.A2 2.09,37.83 | D36.A1 1.58,34.43 1.29,32.32 1.33,32.28 | 1.38,30 D38.A3 D38.A2 D38.A1 | 2.71,22.36 D39.A3 D39.A2 D39.A1 | 6,15.25 D40.A3 | 9.29,10.8 D40.A2 | 10.18,10 D40.A1 | 10.98,9.29 D41.A3 | 15.34,5.82 D41.A2 D41.A1 D42.A3 D42.A2 D42.A1 30,1.38 | 51.52,9.29 D45.A1 | 47.16,5.82 D45.A2 D45.A3 | 45.12,4.76 D44.A1 D44.A2 D44.A3 | 37.83,2 D43.A1 | 32.32,1.29 D43.A2 D43.A3 | 56.5,47.25 D27.A2 D27.A3 D26.A1 D26.A2 D26.A3 61.21,32.32 D25.A2 D25.A3 | 51.7,53.12 D28.A2 D28.A3 | 32.41,61.03 34.92,60.76 | 32.32,61.21 D31.A2 30,61.12 D32.A3 D32.A2 D32.A1 | D35.A1 D35.A2 | D37.A1 D37.A2 | 1.29,31.34 D37.A3
  Bottom 0.406: J2.2 45.79,17.05 v47.12,18.38 | v33.47,53.65 34.84,55.02 v34.84,58.65